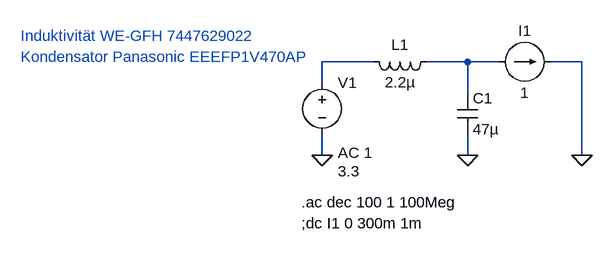
[diagram p0: schematic Pi_Filter.asc]
Pi_Filter.asc, the LTspice schematic file:
Version 4
SHEET 1 880 680
WIRE 96 128 16 128
WIRE 240 128 176 128
WIRE 288 128 240 128
WIRE 416 128 368 128
WIRE 16 160 16 128
WIRE 240 176 240 128
WIRE 16 272 16 240
WIRE 240 272 240 240
WIRE 416 272 416 128
FLAG 240 272 0
FLAG 16 272 0
FLAG 416 272 0
SYMBOL ind 192 112 R90
WINDOW 0 5 56 VBottom 2
WINDOW 3 32 56 VTop 2
SYMATTR InstName L1
SYMATTR Value 2.2µ
SYMATTR SpiceLine Rser=0.5
SYMBOL cap 224 176 R0
SYMATTR InstName C1
SYMATTR Value 47µ
SYMATTR SpiceLine Rser=0.26
SYMBOL voltage 16 144 R0
WINDOW 3 24 152 Left 2
WINDOW 123 24 124 Left 2
WINDOW 39 0 0 Left 2
SYMATTR Value 3.3
SYMATTR Value2 AC 1
SYMATTR InstName V1
SYMBOL current 288 128 R270
WINDOW 0 32 40 VTop 2
WINDOW 3 -32 40 VBottom 2
WINDOW 123 0 0 Left 2
WINDOW 39 0 0 Left 2
SYMATTR InstName I1
SYMATTR Value 1
TEXT -16 344 Left 2 !.ac dec 100 1 100Meg
TEXT -16 376 Left 2 !;dc I1 0 300m 1m
TEXT -448 88 Left 2 ;Induktivität WE-GFH 7447629022
TEXT -448 120 Left 2 ;Kondensator Panasonic EEEFP1V470AP

The netlist it stands for:
* Pi_Filter.asc
L1 N002 N001 2.2µ Rser=0.5
C1 N002 0 47µ Rser=0.26
V1 N001 0 3.3 AC 1
I1 N002 0 1
.ac dec 100 1 100Meg
;dc I1 0 300m 1m
* Induktivität WE-GFH 7447629022
* Kondensator Panasonic EEEFP1V470AP
.backanno
.end